# EAGLE design CurvedThumbs (EAGLE 9.1.1)
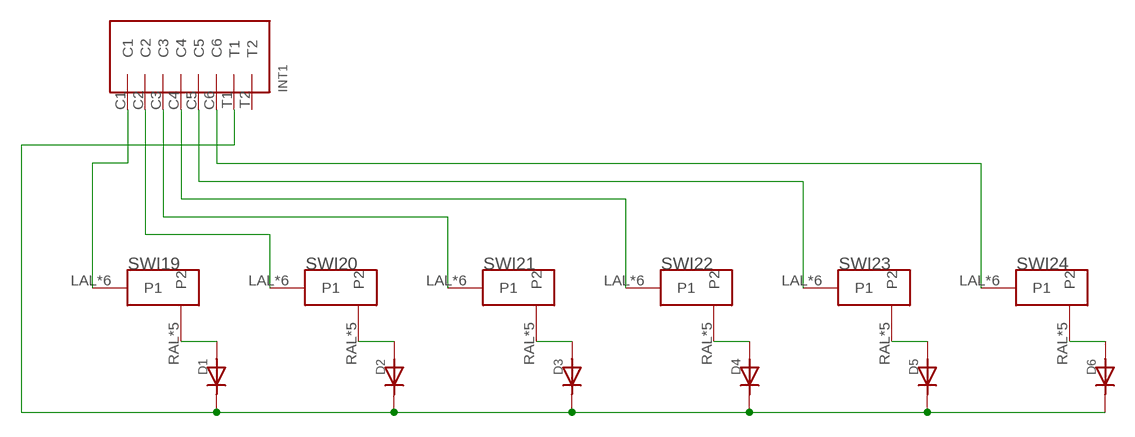
[diagram p0: schematic, sheet 1]

## Parts
D1  DIODE  [DIODE_COMBO]
D2  DIODE  [DIODE_COMBO]
D3  DIODE  [DIODE_COMBO]
D4  DIODE  [DIODE_COMBO]
D5  DIODE  [DIODE_COMBO]
D6  DIODE  [DIODE_COMBO]
INT1  INTRCNNT4X2  [INTRRIBBON]
SWI19  MX/ALPSDOUBLESIDED  [DOUBLED_MX/ALPS]
SWI20  MX/ALPSDOUBLESIDED  [DOUBLED_MX/ALPS]
SWI21  MX/ALPSDOUBLESIDED  [DOUBLED_MX/ALPS]
SWI22  MX/ALPSDOUBLESIDED  [DOUBLED_MX/ALPS]
SWI23  MX/ALPSDOUBLESIDED  [DOUBLED_MX/ALPS]
SWI24  MX/ALPSDOUBLESIDED  [DOUBLED_MX/ALPS]

## Nets
N$1: D1.ANOSB(AN) D1.ANOST(AN) D1.ANOT(AN) SWI19.RAL(P2) SWI19.RAR(P2) SWI19.RCL(P2) SWI19.RCR(P2) SWI19.RLMID(P2)
N$2: D2.ANOSB(AN) D2.ANOST(AN) D2.ANOT(AN) SWI20.RAL(P2) SWI20.RAR(P2) SWI20.RCL(P2) SWI20.RCR(P2) SWI20.RLMID(P2)
N$3: D3.ANOSB(AN) D3.ANOST(AN) D3.ANOT(AN) SWI21.RAL(P2) SWI21.RAR(P2) SWI21.RCL(P2) SWI21.RCR(P2) SWI21.RLMID(P2)
N$4: D4.ANOSB(AN) D4.ANOST(AN) D4.ANOT(AN) SWI22.RAL(P2) SWI22.RAR(P2) SWI22.RCL(P2) SWI22.RCR(P2) SWI22.RLMID(P2)
N$5: D5.ANOSB(AN) D5.ANOST(AN) D5.ANOT(AN) SWI23.RAL(P2) SWI23.RAR(P2) SWI23.RCL(P2) SWI23.RCR(P2) SWI23.RLMID(P2)
N$6: D6.ANOSB(AN) D6.ANOST(AN) D6.ANOT(AN) SWI24.RAL(P2) SWI24.RAR(P2) SWI24.RCL(P2) SWI24.RCR(P2) SWI24.RLMID(P2)
N$7: INT1.C1 SWI19.LAL(P1) SWI19.LAR(P1) SWI19.LCL(P1) SWI19.LCR(P1) SWI19.LLP(P1) SWI19.LRLP(P1)
N$8: INT1.C2 SWI20.LAL(P1) SWI20.LAR(P1) SWI20.LCL(P1) SWI20.LCR(P1) SWI20.LLP(P1) SWI20.LRLP(P1)
N$9: INT1.C3 SWI21.LAL(P1) SWI21.LAR(P1) SWI21.LCL(P1) SWI21.LCR(P1) SWI21.LLP(P1) SWI21.LRLP(P1)
N$10: INT1.C4 SWI22.LAL(P1) SWI22.LAR(P1) SWI22.LCL(P1) SWI22.LCR(P1) SWI22.LLP(P1) SWI22.LRLP(P1)
N$11: INT1.C5 SWI23.LAL(P1) SWI23.LAR(P1) SWI23.LCL(P1) SWI23.LCR(P1) SWI23.LLP(P1) SWI23.LRLP(P1)
N$12: INT1.C6 SWI24.LAL(P1) SWI24.LAR(P1) SWI24.LCL(P1) SWI24.LCR(P1) SWI24.LLP(P1) SWI24.LRLP(P1)
N$13: D1.CATSB(CAT) D1.CATST(CAT) D1.CATT(CAT) D2.CATSB(CAT) D2.CATST(CAT) D2.CATT(CAT) D3.CATSB(CAT) D3.CATST(CAT) D3.CATT(CAT) D4.CATSB(CAT) D4.CATST(CAT) D4.CATT(CAT) D5.CATSB(CAT) D5.CATST(CAT) D5.CATT(CAT) D6.CATSB(CAT) D6.CATST(CAT) D6.CATT(CAT) INT1.T1
Unconnected: INT1.T2

## Library data of the parts
D1-D6 = Keys:DIODE
INT1 = Keys:INTRCNNT
SWI19-SWI24 = Keys:MX/ALPS

## Board
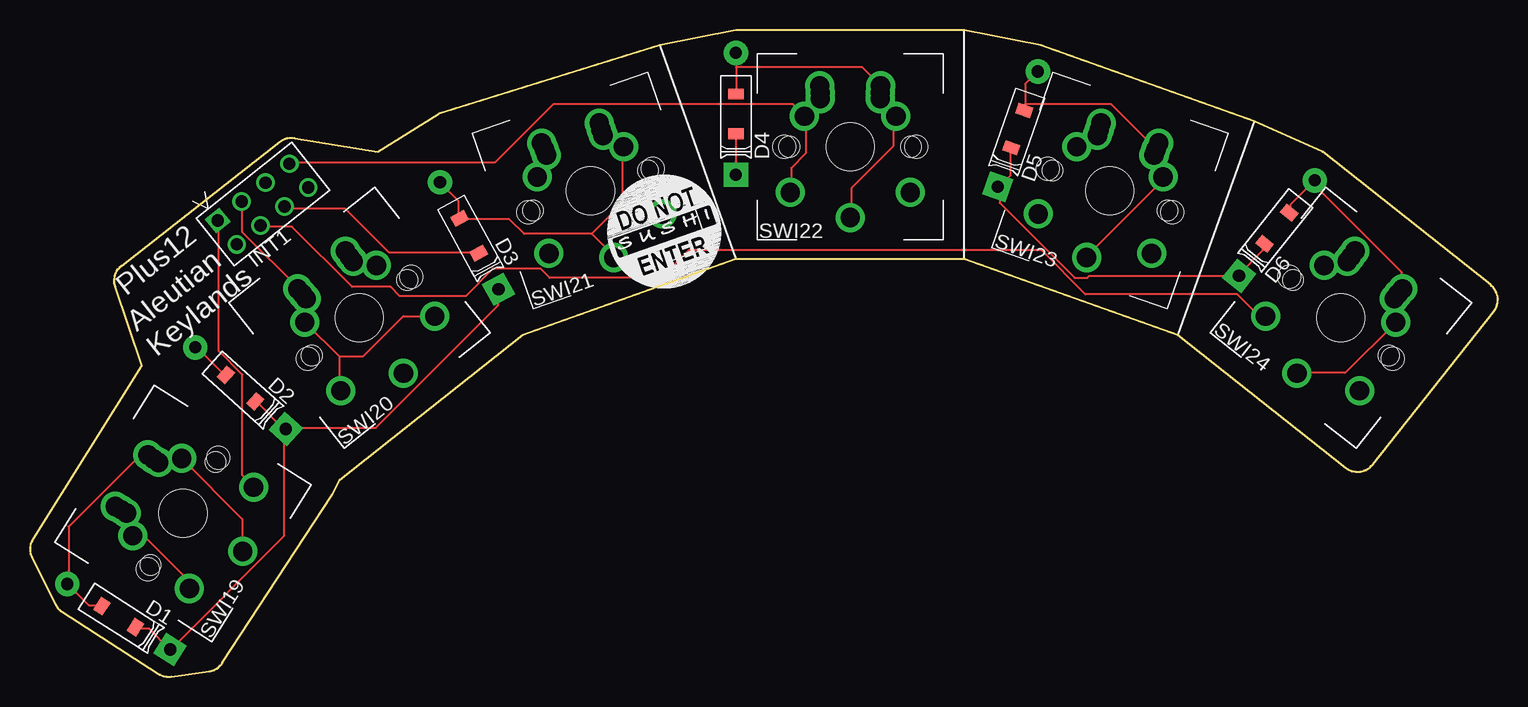
[diagram p1: board, top side]
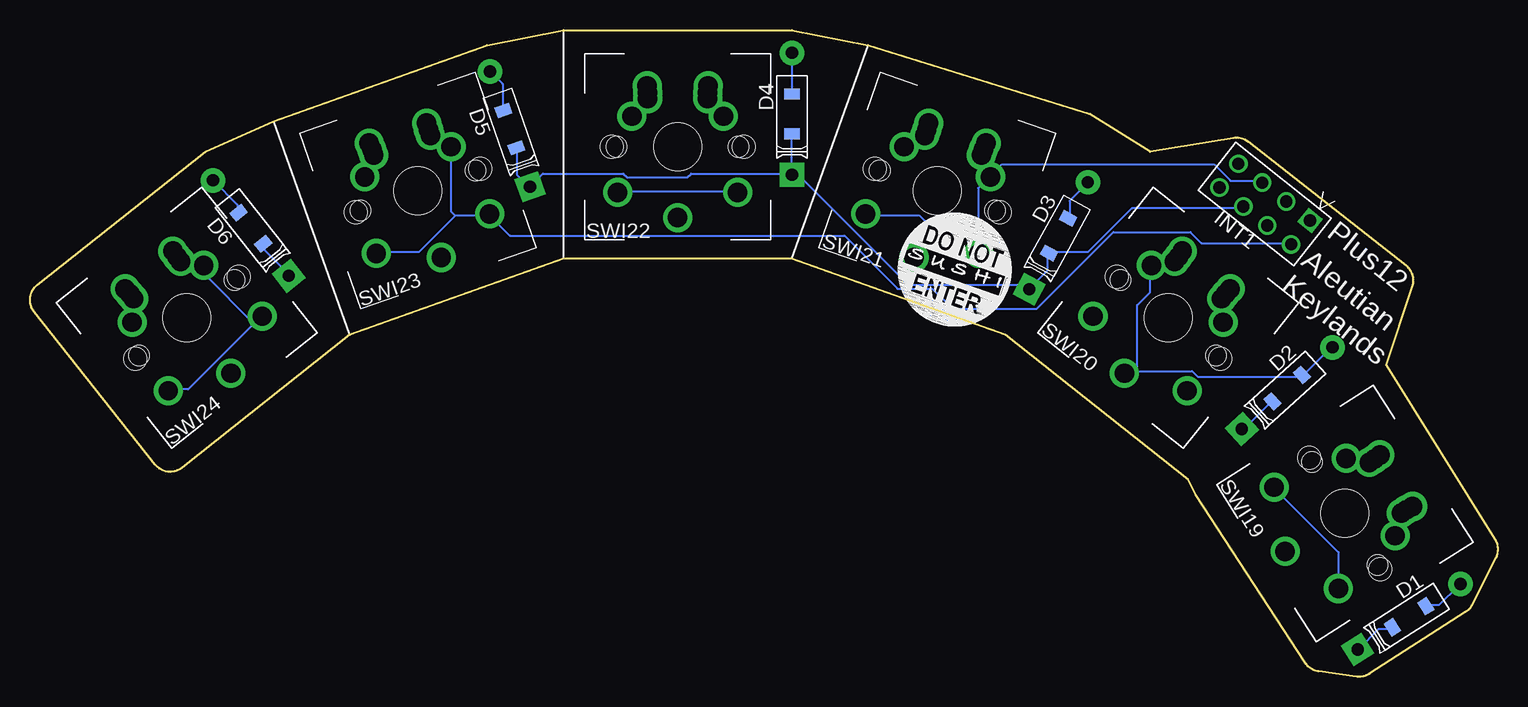
[diagram p2: board, bottom side, seen from below]

Size 122.32 x 53.91 mm. Coordinates in mm from the lower left corner, seen from the top.
Outline: 95.65,28.51 109.65,17.43 arc90 111.88,17.69 121.97,30.44 arc90 121.71,32.67 107.72,43.75 102,46.29 84.22,52.64 77.87,53.91 58.82,53.91 52.47,52.64 34.06,46.92 28.98,43.75 22.05,44.9 arc48 20.81,44.59 7.64,34.28 arc70 7.11,32.52 9.29,25.97 0.24,11.48 arc59 0.17,9.93 2.11,6.04 arc31 2.68,5.41 10.7,0.25 arc41 11.78,0.02 14.93,0.46 arc49 16.04,1.17 25.17,15.17 25.8,16.44 41.04,28.51 58.82,34.86 77.87,34.86 95.65,28.51
Copper layers (1*16): Top 0.035mm / dielectric 1.5mm / Bottom 0.035mm
Design rules "Sierra": minimum track width 6mil, minimum drill 0.45mm, track to track 6mil, track to pad 6mil, pad to pad 6mil, via to via 6mil, smd to smd 6mil, copper to edge 0.4mm, drill to drill 10mil, minimum pad ring 10mil, minimum via ring 8mil, stop-mask expansion 4mil, vias tented up to drill 0mil, thermal gap 10mil

### Footprints (pad centres in the part's own frame; a part is rotated, then mirrored left to right if it is on the bottom)
DIODE_COMBO = smd 0.914 x 1.27 bottom: ANOSB 1.651,0; CATSB -1.651,0 | smd 0.914 x 1.27: ANOST 1.651,0; CATST -1.651,0 | drill 1.016 pad 2.032: ANOT 5.08,0 | drill 1.016 pad 2.032 square: CATT -5.08,0
INTRRIBBON = drill 1.016 square: C1 0,0 | drill 1.016: C2 2.54,0; C3 5.08,0; C4 7.62,0; C5 0,-2.54; C6 2.54,-2.54; T1 5.08,-2.54; T2 7.62,-2.54
DOUBLED_MX/ALPS = drill 1.613: LAL -2.5,4; LAR -2.5,4.5; LCL -3.81,2.54; LCR -2.54,5.08; LLP -5,-3.8; LRLP 5,-3.8; RAL 2.5,4; RAR 2.5,4.5; RCL 3.81,2.54; RCR 2.54,5.08; RLMID 0,-5.9 | hole 3.988: 0,0 | hole 1.702: -5.08,0; 5.08,0 | hole 1.9: -5.5,0; 5.5,0

### Placement (x,y rotation side)
D1  7.39,5.01 147.6 top
D2  17.55,24.06 138 top
D3  36.6,36.76 118.7 top
D4  58.82,46.92 90 top
D5  82.32,45.65 70.8 top
D6  103.91,37.4 51.6 top
INT1  15.64,38.03 38.4 top
SWI19  12.75,13.62 57.6 top
SWI20  27.46,29.93 38.4 top
SWI21  46.71,40.52 19.2 top
SWI22  68.35,44.18 0 top
SWI23  89.99,40.52 340.8 top
SWI24  109.24,29.93 321.6 top
U$1  [3_8INCH_TOP]  49.93,31.05 19.2 top
U$2  [3_8INCH_BOT]  42.31,27.87 19.2 top

### Tracks (layer width: path | path; a pad name or v marks a point on that pad's centre or on a via)
N$1
  Top 0.152: D1.ANOST 5.97,5.98 4.9,5.98 3.22,7.65 D1.ANOT 3.22,7.81 3.22,12.53 9.17,18.47 9.78,18.47 | 9.78,18.47 SWI19.RAR 9.78,18.47 | 9.78,18.47 SWI19.RCR 10.39,18.02 10.69,18.02 SWI19.RAL 10.84,18.02 11,18.17 12.52,18.17 SWI19.RCL 12.67,18.17 17.7,13.14 17.7,10.55 SWI19.RLMID
  Bottom 0.152: D1.ANOST 5.97,5.98 4.9,5.98 3.22,7.65 D1.ANOT
N$2
  Top 0.152: SWI20.RAR 26.54,35.09 26.24,35.39 SWI20.RCR | SWI20.RCL 28.83,34.32 27.15,34.32 27,34.48 SWI20.RAR | SWI20.RAL 26.85,34.63 SWI20.RAR | D2.ANOST 16.18,25.18 13.89,27.47 D2.ANOT
  Bottom 0.152: D2.ANOT 13.89,27.47 16.18,25.18 D2.ANOST 16.33,25.03 25.02,25.03 25.47,25.48 30.05,25.48 | 30.05,25.48 30.96,25.48 31.11,25.33 SWI20.RLMID 30.05,25.48 | 30.05,25.48 30.05,30.97 28.98,32.04 28.98,34.17 SWI20.RCL
N$3
  Top 0.152: 47.72,45.14 47.72,45.45 SWI21.RAR | 47.72,45.14 SWI21.RCR | SWI21.RAR 47.88,44.99 48.64,44.23 49.4,44.23 SWI21.RCL 49.4,44.08 49.4,39.5 46.81,36.91 | 47.72,45.14 SWI21.RAL | 47.72,45.14 SWI21.RAR | D3.ANOT 34.16,41.18 35.69,39.66 35.69,38.29 D3.ANOST 35.84,38.13 39.95,38.13 41.17,36.91 46.81,36.91 | 46.81,36.91 48.64,35.09 SWI21.RLMID
  Bottom 0.152: D3.ANOST 35.69,38.29 35.69,39.66 34.16,41.18 D3.ANOT
N$4
  Top 0.152: SWI22.RLMID 68.45,38.29 68.45,40.72 71.96,44.23 71.96,46.52 72.11,46.67 SWI22.RCL 72.11,46.82 70.89,48.04 SWI22.RAR | 58.85,50.78 58.85,52 D4.ANOT | 58.85,50.78 58.85,48.65 D4.ANOST | 58.85,50.78 69.37,50.78 SWI22.RCR | SWI22.RCR SWI22.RAL 70.89,48.65 SWI22.RAR | SWI22.RCR SWI22.RAR
  Bottom 0.152: D4.ANOST 58.85,48.65 58.85,52 D4.ANOT
N$5
  Top 0.152: SWI23.RLMID 88.11,35.09 94.36,41.33 94.36,41.64 SWI23.RCL 94.36,41.79 94.36,42.86 93.75,43.47 SWI23.RCR 94.05,44.38 93.75,44.08 | 82.93,47.73 82.93,49.41 83.84,50.33 D5.ANOT | 82.93,47.73 82.93,47.28 D5.ANOST | 82.93,47.73 90.09,47.73 93.75,44.08 | 93.75,44.08 SWI23.RAL 93.75,43.92 SWI23.RAR 93.75,44.08
  Bottom 0.152: D5.ANOST 82.93,47.28 82.93,49.41 83.84,50.33 D5.ANOT
N$6
  Top 0.152: SWI24.RLMID 105.64,25.33 109.6,25.33 113.71,29.45 SWI24.RCL 113.71,29.6 113.71,31.43 SWI24.RCR 114.32,32.34 | 106.86,41.18 107.01,41.33 D6.ANOT 106.86,41.18 | 106.86,41.18 105.03,39.35 105.03,38.74 D6.ANOST | 106.86,41.18 114.32,33.71 114.32,32.34 | 114.32,32.34 SWI24.RAR 114.02,31.88 113.71,31.58 SWI24.RAL 114.32,32.34
  Bottom 0.152: D6.ANOST 105.03,38.74 105.03,39.35 107.01,41.33 D6.ANOT
N$7
  Top 0.152: 7.64,14.05 7.95,13.75 SWI19.LAL | 7.64,14.05 SWI19.LCR | SWI19.LAL 8.1,13.6 8.56,13.14 SWI19.LCL 8.71,11.62 9.62,11.62 13.13,8.11 13.13,7.5 SWI19.LLP | 7.64,14.05 SWI19.LAR | 7.64,14.05 SWI19.LAL | INT1.C1 15.72,37.98 15.72,27.16 17.7,25.18 17.7,16.8 18.62,15.88 SWI19.LRLP
  Bottom 0.152: SWI19.LLP 13.28,7.5 13.28,10.4 18.62,15.73 SWI19.LRLP
N$8
  Top 0.152: 22.43,32.34 17.7,37.07 17.7,39.5 INT1.C2 | 22.43,32.34 SWI20.LAR 22.73,31.88 SWI20.LCR 22.43,32.34 | 25.78,26.7 25.78,23.96 SWI20.LLP | 25.78,26.7 23.04,29.45 SWI20.LCL 23.04,29.6 23.04,31.43 SWI20.LAL 22.43,32.34 | 25.78,26.7 27.76,26.7 31.11,30.06 33.7,30.06 SWI20.LRLP
N$9
  Top 0.152: SWI21.LAR 43,43.92 43,43.62 SWI21.LAL 43,44.08 42.7,44.38 SWI21.LCR
  Bottom 0.152: 41.78,42.25 42.24,41.79 SWI21.LCL | 41.78,42.25 41.32,42.71 23.65,42.71 22.27,41.33 19.68,41.33 INT1.C3 | 43.31,37.98 43.31,40.72 42.39,41.64 SWI21.LCL | 43.31,37.98 43.31,35.39 SWI21.LLP | 43.31,37.98 47.72,37.98 48.18,38.44 52.6,38.44 SWI21.LRLP | 41.78,42.25 43,43.47 SWI21.LCR | 41.78,42.25 SWI21.LCL
N$10
  Top 0.152: SWI22.LAL 65.86,48.19 65.86,48.65 SWI22.LAR | SWI22.LCR 65.86,49.26 65.86,48.8 SWI22.LAL | 64.49,46.82 63.57,47.73 43.61,47.73 38.73,42.86 21.66,42.86 INT1.C4 | 64.49,46.82 SWI22.LCL | SWI22.LLP 63.42,40.42 63.42,42.4 64.64,43.62 64.64,46.67 SWI22.LCL | 64.49,46.82 65.71,48.04 SWI22.LAL | 64.49,46.82 SWI22.LCL
  Bottom 0.152: SWI22.LRLP 73.33,40.42 63.42,40.42 SWI22.LLP
N$11
  Top 0.152: SWI23.LCL 87.35,44.23 88.11,44.23 88.87,44.99 SWI23.LAR 88.87,45.14 SWI23.LAL 89.18,45.6 89.18,46.06 SWI23.LCR
  Bottom 0.152: INT1.C5 17.24,36.15 24.71,36.15 25.63,37.07 32.03,37.07 38.43,30.67 45.44,30.67 47.12,32.34 50.01,32.34 54.43,36.76 82.32,36.76 84,38.44 SWI23.LLP 84.15,38.44 86.89,38.44 | 86.89,38.44 89.94,35.39 93.44,35.39 SWI23.LRLP | 86.89,38.44 87.2,38.74 87.2,44.08 SWI23.LCL
N$12
  Top 0.152: SWI24.LCL 107.92,34.32 109.6,34.32 109.75,34.48 SWI24.LAR 109.9,34.63 SWI24.LAL 110.06,35.09 110.36,35.39 SWI24.LCR | INT1.C6 19.23,37.52 21.82,37.52 26.85,32.49 30.05,32.49 30.81,31.73 36.29,31.73 38.58,34.02 42.54,34.02 43.31,33.26 52.6,33.26 54.89,35.54 84.3,35.54 87.96,31.88 100.61,31.88 102.28,30.21 102.89,30.21 SWI24.LLP
  Bottom 0.152: 103.66,29.45 103.05,30.06 SWI24.LLP 103.66,29.45 | 103.66,29.45 109.14,23.96 110.67,23.96 SWI24.LRLP | 103.66,29.45 107.77,33.56 107.77,34.17 SWI24.LCL
N$13
  Top 0.152: D4.CATST 58.85,45.14 58.85,41.94 D4.CATT | D6.CATST 102.74,36 102.74,35.54 100.76,33.56 D6.CATT 100.61,33.41 88.26,33.41 88.11,33.26 87.04,33.26 80.8,39.5 80.8,40.72 D5.CATT 80.8,40.88 81.71,41.79 81.71,44.08 D5.CATST | D3.CATST 37.36,35.39 29.89,35.39 26.24,39.05 21.21,39.05 INT1.T1 | 21.21,20.61 18.92,22.89 D2.CATST | 21.21,20.61 D2.CATT | D1.CATST 8.86,4 9.93,4 11.61,2.32 D1.CATT 11.76,2.32 21.21,11.77 21.21,20.61 | 21.21,20.61 D2.CATT | D3.CATT 39.04,32.19 39.04,30.97 28.83,20.76 21.36,20.76 D2.CATT
  Bottom 0.152: 58.85,41.94 58.85,45.14 D4.CATST | 58.85,41.94 D4.CATT | D6.CATST 102.74,36 102.74,35.54 100.76,33.56 D6.CATT | D5.CATST 81.71,44.08 81.71,41.79 80.8,40.88 D5.CATT 80.64,40.88 79.58,41.94 72.87,41.94 72.57,41.64 67.54,41.64 67.23,41.94 58.85,41.94 | 58.85,41.94 D4.CATT | INT1.T1 21.21,39.05 30.5,39.05 34.16,35.39 37.36,35.39 D3.CATST 37.51,35.24 37.51,33.87 39.04,32.34 D3.CATT 39.19,32.34 39.5,32.65 49.1,32.65 58.24,41.79 58.7,41.79 D4.CATT | D2.CATST 18.92,22.89 21.21,20.61 D2.CATT | D1.CATST 8.86,4 9.93,4 11.61,2.32 D1.CATT

### Text on the board
tPlace: Plus12 | Aleutian / Keylands
bPlace: Plus12 | Aleutian / Keylands